# Altium schematic sheet Stepper_driver.SchDoc
size B; Author: AM; CompanyName: Expatria Technologies; DrawnBy: A.Marles; Engineer: AM; Organization: Expatria Technologies; DocumentNumber: 9; Revision: A1; SheetNumber: 9; SheetTotal: 14; PCB_Rev: A1
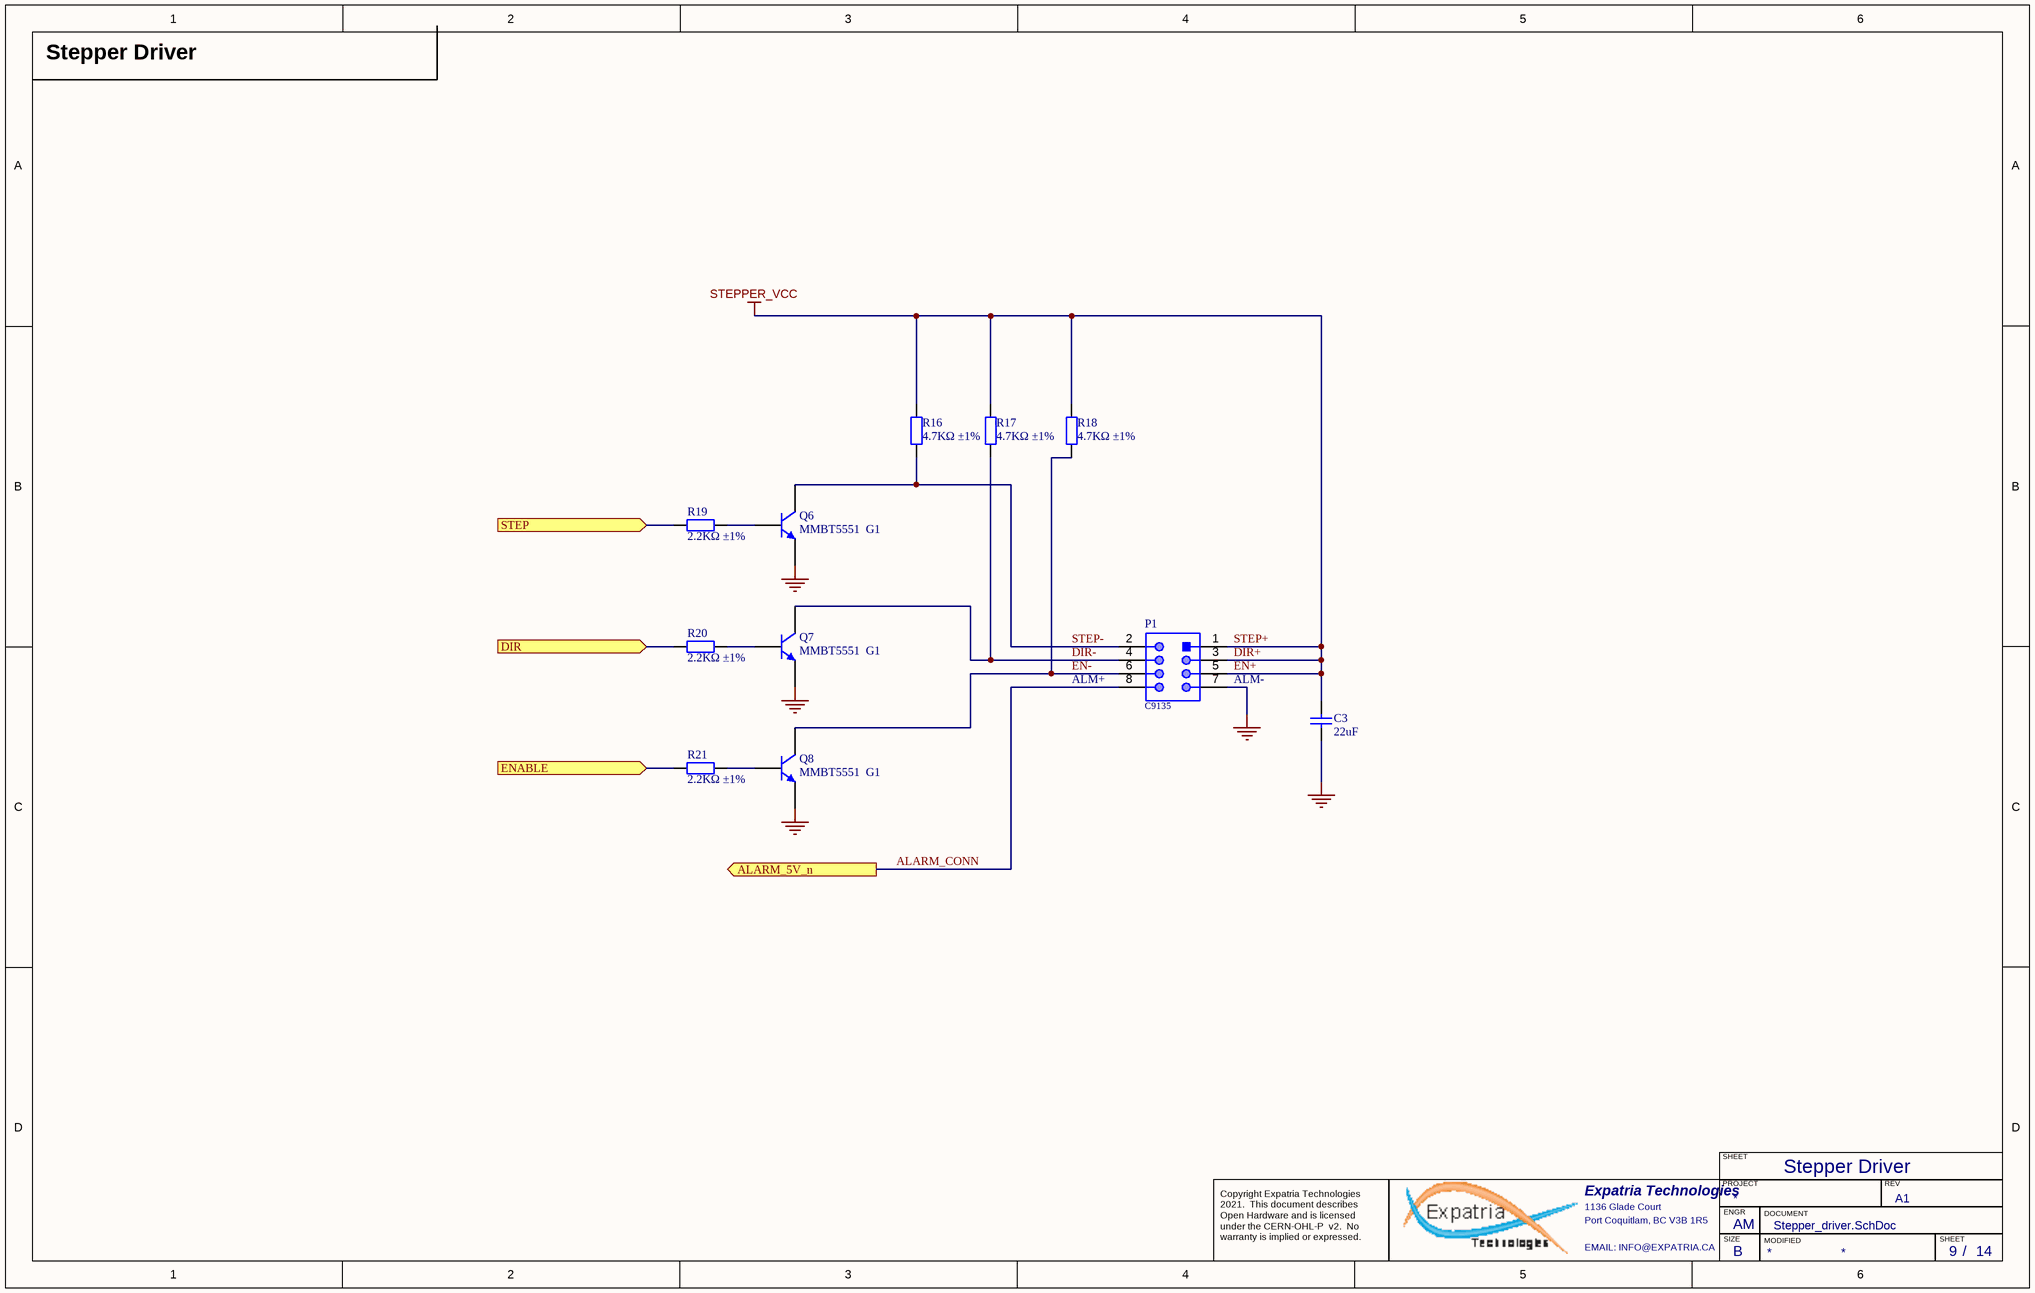
[diagram p0: Stepper_driver.SchDoc]

## Parts
C3  22uF  [0805_C]
P1  C9135  [61200821621]
Q6  MMBT5551  G1  [SOT-23(SOT-23-3)]
Q7  MMBT5551  G1  [SOT-23(SOT-23-3)]
Q8  MMBT5551  G1  [SOT-23(SOT-23-3)]
R16  4.7KΩ ±1%  [0402_R]
R17  4.7KΩ ±1%  [0402_R]
R18  4.7KΩ ±1%  [0402_R]
R19  2.2KΩ ±1%  [0402_R]
R20  2.2KΩ ±1%  [0402_R]
R21  2.2KΩ ±1%  [0402_R]

## Ports
ALARM_5V_n (out), DIR (in), ENABLE (in), STEP (in)

## Nets
DIR+: C3.2 P1.1 P1.3 P1.5 R16.2 R17.2 R18.2  [also labelled EN+, STEP+, STEPPER_VCC]
GND: C3.1 P1.7 Q6.2(E) Q7.2(E) Q8.2(E)
ALARM_CONN: P1.8 ; port ALARM_5V_n
DIR: R20.1 ; port DIR
DIR-: P1.4 Q7.3(C) R17.1
EN-: P1.6 Q8.3(C) R18.1
ENABLE: R21.1 ; port ENABLE
STEP: R19.1 ; port STEP
STEP-: P1.2 Q6.3(C) R16.1
NetQ6_1: Q6.1(B) R19.2
NetQ7_1: Q7.1(B) R20.2
NetQ8_1: Q8.1(B) R21.2

## Notes on the sheet
- Stepper Driver
- (near P1) ALM+
- (near P1) ALM-
- SHEET
- Expatria Technologies
- 1136 Glade Court
- Port Coquitlam, BC V3B 1R5
- PROJECT
- SIZE
- ENGR
- MODIFIED
- DOCUMENT
- REV
- Copyright Expatria Technologies 2021.  This document describes Open Hardware and is licensed under the CERN-OHL-P  v2.  No warranty is implied or expressed.
- EMAIL: INFO@EXPATRIA.CA
- B
- /

## Library data of the parts
C3 = 0805 22uF (226) 20% 25V: Chip capacitors; Manufacturer: Samsung Electro-Mechanics; PartNumber: CL21A226MAQNNNE; Tolerance: 20%; Voltage: 25V; Package: 0805; Supplier: LC; SuppliersPartNumber: C45783; Capacitance: 22uF
P1 = CMP-1502-00006-1: Male Box Header WR-BHD, THT, Vertical, pitch 2.54 mm, 8 pins; Manufacturer: Wurth Elektronik; Pitch: 2.54mm; Publisher: WurthElektronik; Part Number: C9135; Packaging: Tray; Published Date: August2018; Package Reference: 61200821621; SuppliersPartNumber: C9135
Q6-Q8 = SOT-23 MMBT5551  G1: 三极管; Package: SOT-23; Supplier: LC; SuppliersPartNumber: C2145
R16-R18 = 0402 4.7K (4701) 1%: Chip resistor; Manufacturer: Uniroyal Elec; PartNumber: 0402WGF4701TCE; Power: 1/16W; Package: 0402; Supplier: LC; SuppliersPartNumber: C25900; Resistance: 4.7KΩ; Tolerance: 1%
R19-R21 = 0402 2.2K (2201) 1%: Chip resistor; Manufacturer: Uniroyal Elec; PartNumber: 0402WGF2201TCE; Power: 1/16W; Package: 0402; Supplier: LC; SuppliersPartNumber: C25879; Resistance: 2.2KΩ; Tolerance: 1%